# EAGLE design Adafruit MCP4725 (EAGLE 8.7.1)
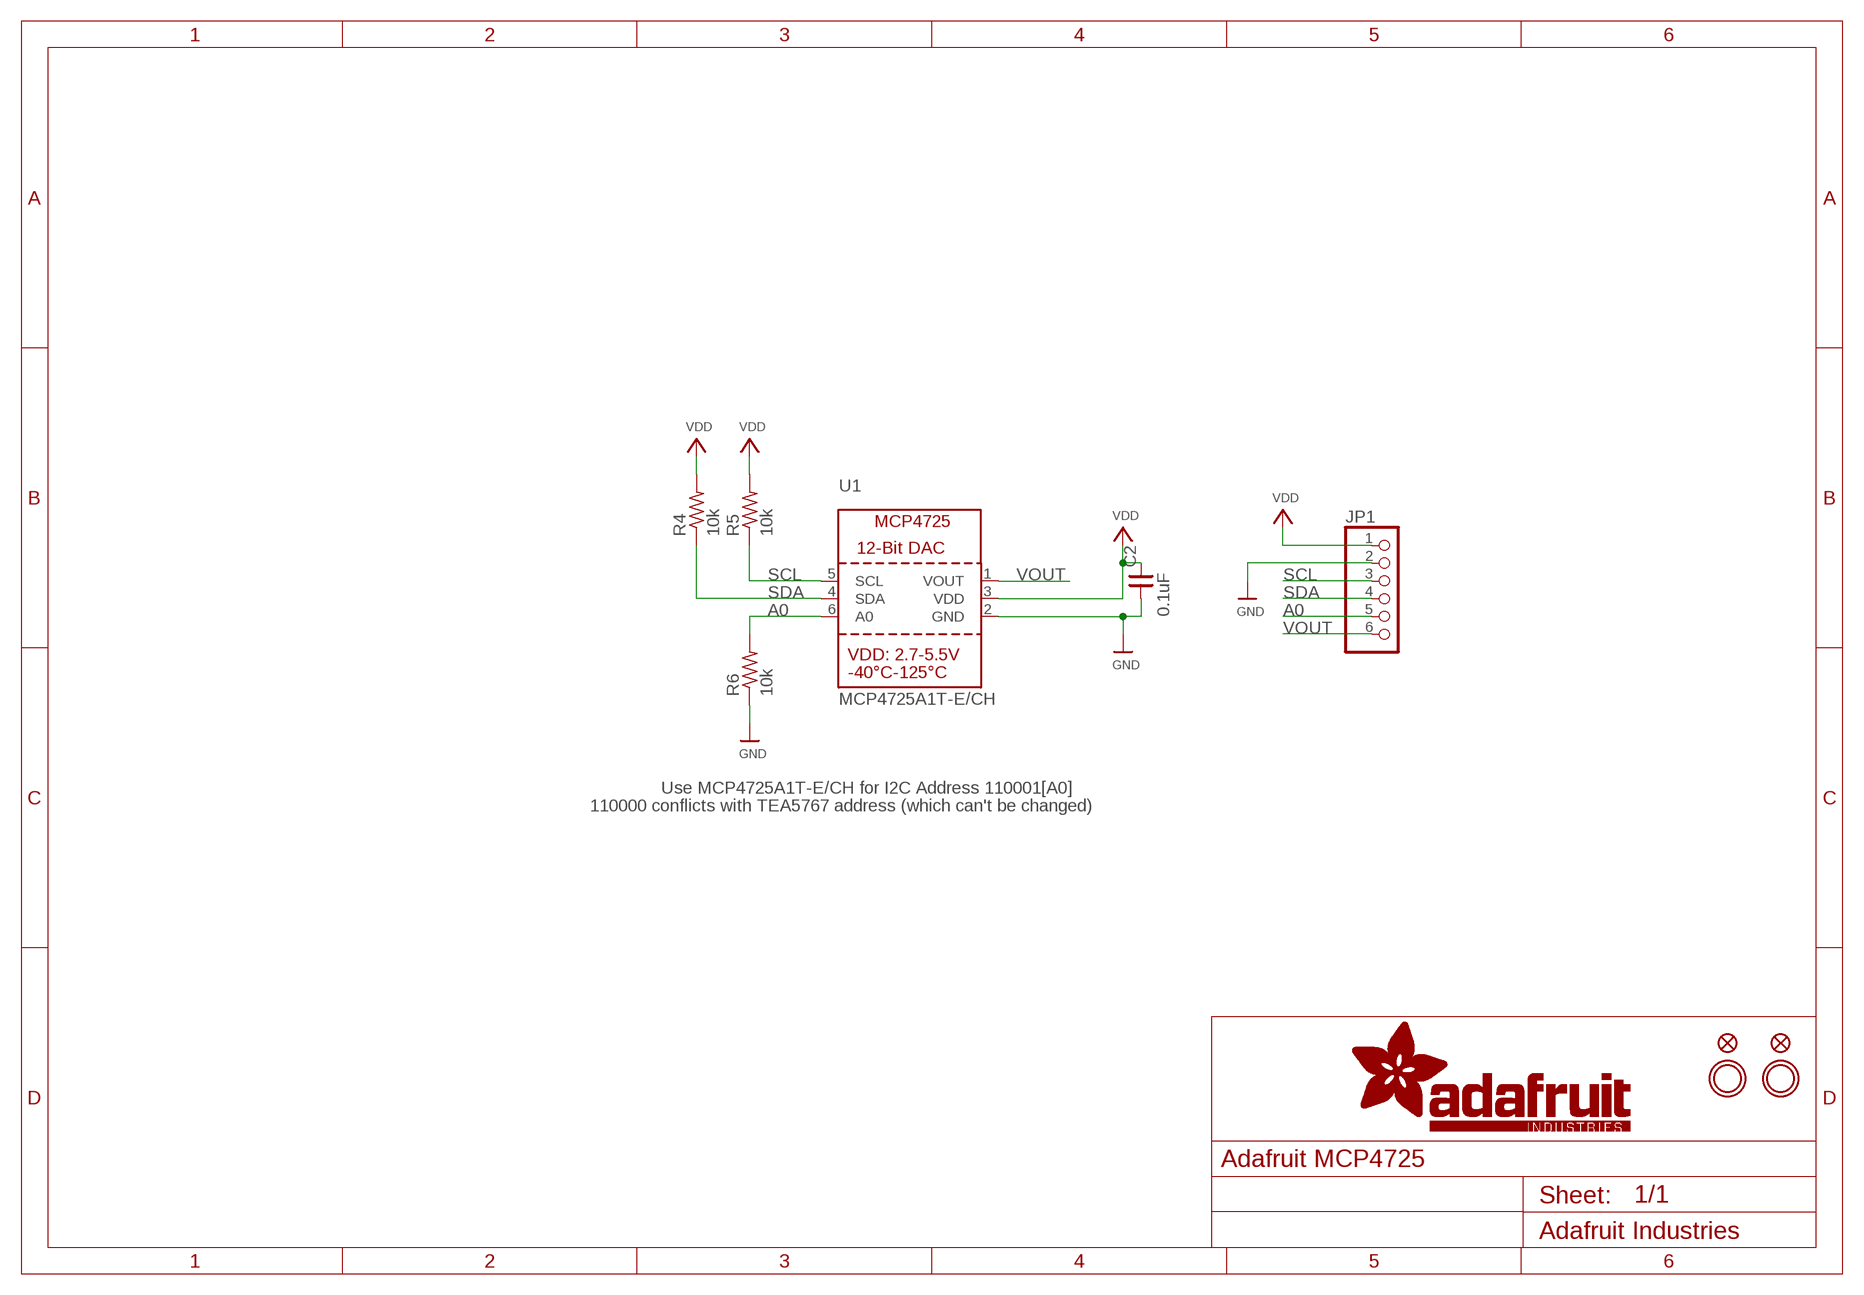
[diagram p0: schematic, sheet 1]

## Parts
C2  0.1uF  CNP-0805  [0805]
FID1  FIDUCIAL""  [FIDUCIAL_1MM]
FID2  FIDUCIAL""  [FIDUCIAL_1MM]
JP1  HEADER-1X670MIL  [1X06_ROUND_70]
R4  10k  R-US_R0805  [R0805]
R5  10k  R-US_R0805  [R0805]
R6  10k  R-US_R0805  [R0805]
U1  MCP4725A1T-E/CH  DAC_MCP4725  [SOT23-6]
U$7  MOUNTINGHOLE2.5  [MOUNTINGHOLE_2.5_PLATED]
U$8  MOUNTINGHOLE2.5  [MOUNTINGHOLE_2.5_PLATED]

## Nets
A0: JP1.5 R6.2 U1.6(A0)
GND: C2.1 JP1.2 R6.1 U1.2(GND)
SCL: JP1.3 R5.1 U1.5(SCL)
SDA: JP1.4 R4.1 U1.4(SDA)
VDD: C2.2 JP1.1 R4.2 R5.2 U1.3(VDD)
VOUT: JP1.6 U1.1(VOUT)

## Notes on the sheet
- Use MCP4725A1T-E/CH for I2C Address 110001[A0]
- 110000 conflicts with TEA5767 address (which can't be changed)

## Library data of the parts
C2 = cap-master:CNP-: NON-POLARIZED CAP
FID1 FID2 = microbuilder:FIDUCIAL: Fiducial Alignment Points Various fiducial points for machine vision alignment.
JP1 = microbuilder:HEADER-1X6: PIN HEADER
R4-R6 = adafruit:R-US_: RESISTOR, American symbol
U1 = microbuilder:DAC_MCP4725: MCP4725 - 12-Bit I2C DAC with on-board EEPROM Settling Time: 6 µs 2.7-5.5V Supply 100kHz, 400kHz, 3.4 Mbps I²C EEPROM can be used to store a specific output voltage which will be set coming out of reset I²C Address: 1100 A2 A1 A0 A0 is set via the A0 pin, A2 and A1 are hard-wired on the chip depending on the model chosen: Part Number A2 A1 Code MCP4725A0T-E/CH 0 0 AJNN MCP4725A1T-E/CH 0 1 APNN MCP4725A2T-E/CH 1 0 AQNN MCP4725A3T-E/CH 1 1 ARNN
U$7 U$8 = microbuilder:MOUNTINGHOLE: Mounting Hole For #2 screws (0.086"/2.18mm width, 0.094"/2.4mm hole) use 2.5mm

## Board
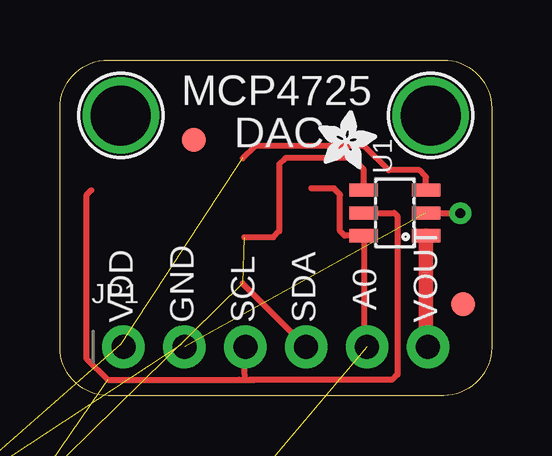
[diagram p1: board, top side]
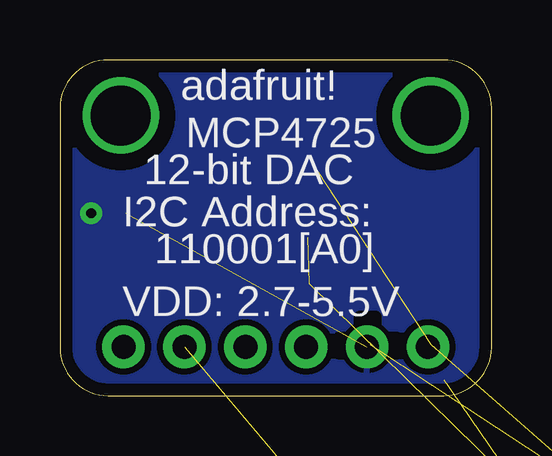
[diagram p2: board, bottom side, seen from below]

Size 18 x 14 mm. Coordinates in mm from the lower left corner, seen from the top.
Outline: 0,2 0,12 arc-90 2,14 16,14 arc-90 18,12 18,2 arc-90 16,0 2,0 arc-90 0,2
Copper layers (1*16): Top 0.035mm / dielectric 1.5mm / Bottom 0.035mm
Design rules "default": minimum track width 8mil, minimum drill 0.4mm, track to track 8mil, track to pad 8mil, pad to pad 8mil, via to via 8mil, smd to smd 8mil, copper to edge 20mil, drill to drill 8mil, minimum pad ring 8mil, minimum via ring 10mil, stop-mask expansion 3mil, vias tented up to drill 20mil, thermal gap 8mil
bRestrict: area 4.8,3.1 to 5.5,3.3; area 6.2,1.8 to 6.4,2.4; area 4,1.8 to 4.2,2.4

### Footprints (pad centres in the part's own frame; a part is rotated, then mirrored left to right if it is on the bottom)
0805 = smd 1.27 x 1.524: 1 -0.953,0; 2 0.953,0
FIDUCIAL_1MM = smd 1 x 1: 1 0,0
1X06_ROUND_70 = drill 1 pad 1.778: 1 -6.35,0; 2 -3.81,0; 3 -1.27,0; 4 1.27,0; 5 3.81,0; 6 6.35,0
R0805 = smd 1.1 x 1.4: 1 -1,0; 2 1,0
SOT23-6 = smd 0.55 x 1.2: 1 -0.95,-1.3; 2 0,-1.3; 3 0.95,-1.3; 4 0.95,1.3; 5 0,1.3; 6 -0.95,1.3
MOUNTINGHOLE_2.5_PLATED = drill 2.5 pad 3.2: P$1 0,0

### Placement (x,y rotation side)
C2  -11.66,-9.46 0 top  (outside the outline)
FID1  16.82,3.81 0 top
FID2  5.59,10.67 0 top
JP1  9,2.03 0 top
R4  -11.44,-14.96 0 top  (outside the outline)
R5  -11.44,-20.24 0 top  (outside the outline)
R6  -11.44,-25.52 0 top  (outside the outline)
U1  13.97,7.62 90 top
U$7  2.54,11.68 0 top
U$8  15.46,11.68 0 top
U$11  [ADAFRUIT_2.5MM]  10.78,9.46 0 top

### Tracks (layer width: path | path; a pad name or v marks a point on that pad's centre or on a via)
A0  (1 unrouted)
  Top 0.254: 10.48,8.64 11.43,8.64 11.68,8.38 11.68,6.86 11.87,6.67 U1.6 12.67,2.82 12.67,2.17 JP1.5
GND  (via drill 0.4)  (3 unrouted)
  Top 0.254: 5.08,2.14 JP1.2 | U1.2 16.68,7.62 v16.7,7.6
  Bottom 0.254: v16.7,7.6 16.7,7.8
  pour Bottom (isolate 0.254): 0,0 0,14 18,14 18,0
SCL  (1 unrouted)
  Top 0.254: U1.5 13.94,7.62 14.08,7.48 14.08,0.88 13.86,0.66 8.14,0.66 | 8.14,0.66 7.92,0.66 | JP1.3 7.7,2 7.7,0.88 7.7,0.66 | 1.31,8.57 1.1,8.36 1.1,1.54 1.98,0.66 7.48,0.66 7.7,0.66 | 7.7,0.66 8.14,0.66
SDA  (2 unrouted)
  Top 0.254: U1.4 12.67,9.43 12.19,9.91 9.4,9.91 9.14,9.65 9.14,6.86 8.89,6.6 7.69,6.6 | 7.62,4.68 JP1.4
VDD  (4 unrouted)
  Top 0.254: U1.3 15.27,9.11 14.99,9.4 13.72,9.4 12.7,10.41 8.13,10.41 7.62,9.91 | 2.54,2.14 JP1.1
VOUT
  Top 0.61: U1.1 15.27,2.11 JP1.6

### Text on the board
tPlace: MCP4725 | DAC | A0 | VDD | GND | SCL | SDA | VOUT
bPlace: adafruit! | MCP4725 | 12-bit DAC | I2C Address: | 110001[A0] | VDD: 2.7-5.5V